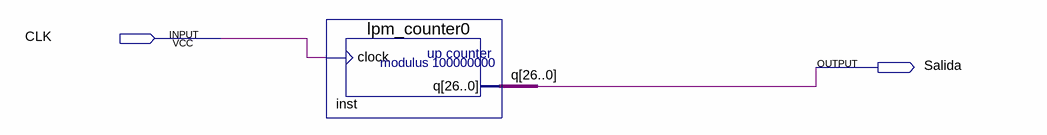
[diagram p0: schematic sheet]
// Quartus schematic Divisor100Mhz.bdf as structural Verilog: 1 symbols, 2 pins
module Divisor100Mhz (
  input  CLK,
  output Salida
);

  wire [26:0] q;

  lpm_counter0 inst (.clock(CLK), .q(q));
endmodule
